# Altium schematic sheet Radio.SchDoc: CATS Telemetry
size A4; Author: Luca Jost; Revision: 1.0; SheetNumber: 5; SheetTotal: 7; Subtitle: Radio
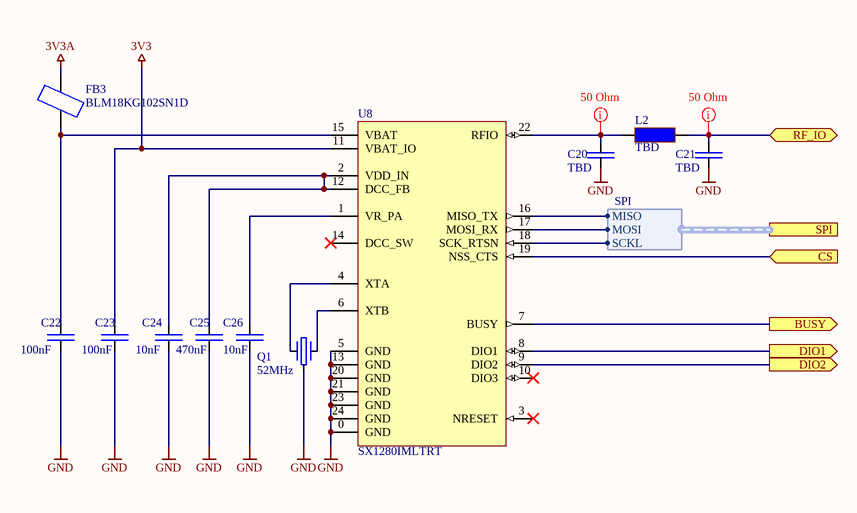
[diagram p0: Radio.SchDoc]

## Parts
C20  TBD  [SMD Keramikkondensator 0402]
C21  TBD  [SMD Keramikkondensator 0402]
C22  100nF  [SMD Keramikkondensator 0603]
C23  100nF  [SMD Keramikkondensator 0603]
C24  10nF  [SMD Keramikkondensator 0603]
C25  470nF  [SMD Keramikkondensator 0603]
C26  10nF  [SMD Keramikkondensator 0603]
FB3  BLM18KG102SN1D  [SMD Ferrite Bead 0603]
L2  TBD  [SMD Ferrite Bead 0402]
Q1  52MHz  [SMD Crystal 3.2X2.5X0.8]
U8  SX1280IMLTRT  [SMD IC QFN-24]

## Ports
BUSY (out), CS (in), DIO1 (out), DIO2 (out), RF_IO (bidir), SPI (harness SPI)

## Harnesses
SPI: SCKL, MOSI, MISO

## Nets
3V3: C23.2 U8.11(VBAT_IO)
3V3A: FB3.2
GND: C20.1 C21.1 C22.1 C23.1 C24.1 C25.1 C26.1 Q1.3 U8.0(GND) U8.5(GND) U8.13(GND) U8.20(GND) U8.21(GND) U8.23(GND) U8.24(GND)
BUSY: U8.7(BUSY) ; port BUSY
CS: U8.19(NSS_CTS) ; port CS
DIO1: U8.8(DIO1) ; port DIO1
DIO2: U8.9(DIO2) ; port DIO2
RF_IO: C21.2 L2.2 ; port RF_IO
NetC20_2: C20.2 L2.1 U8.22(RFIO)
NetC22_2: C22.2 FB3.1 U8.15(VBAT)
NetC24_2: C24.2 C25.2 U8.2(VDD_IN) U8.12(DCC_FB)
NetC26_2: C26.2 U8.1(VR_PA)
NetQ1_1: Q1.1 U8.4(XTA)
NetQ1_2: Q1.2 U8.6(XTB)
NetU8_16: U8.16(MISO_TX) ; port SPI.MISO
NetU8_17: U8.17(MOSI_RX) ; port SPI.MOSI
NetU8_18: U8.18(SCK_RTSN) ; port SPI.SCKL

Not connected (* = marked no-connect by the designer): U8 3(NRESET)* 10(DIO3)* 14(DCC_SW)*

## Layout directives
rule Impedance Constraint [Min = 50.00    Max = 50.00    ]; net class RF-Line 50: NetC20_2, RF_IO

## Notes on the sheet
- Title
- Author:
- Subtitle
- Date:
- Rev:
- CATS
- Sheet
- of
- File:

## Library data of the parts
C20 C21 = E6 - 10pF: SMD Ceramic Capacitor E6; Unit Price: 0.01; Number: -; Supplier: -
C22 C23 = E6 - 100nF: SMD Ceramic Capacitor E6; Unit Price: 0.01; Number: -; Supplier: -
C24 C26 = E6 - 10nF: SMD Ceramic Capacitor E6; Unit Price: 0.01; Number: -; Supplier: -
C25 = E6 - 470nF: SMD Ceramic Capacitor E6; Unit Price: 0.01; Number: -; Supplier: -
FB3 = BLM18KG102SN1D: 1 kOhms @ 100MHz 1 Power Line Ferrite Bead 0603 (1608 Metric) 1A 200mOhm; ComponentLink1Description: Datasheet; ComponentLink1URL: https://www.murata.com/en-us/products/productdata/8796738650142/ENFA0003.pdf; Digikey: 490-17349-1-ND
L2 = Inductor Pi-Matching: Pi-Matchng Inductor
Q1 = Crystal 52MHz - FL520WFMT1: 52MHz ±7ppm Crystal 12pF 30 Ohms 4-SMD, No Lead; ComponentLink1Description: Datasheet; ComponentLink1URL: https://www.diodes.com/assets/Datasheets/FL.pdf
U8 = SX1280IMLTRT: Long Range, Low Power, 2.4 GHz / Transceiver with Ranging Capability; ComponentLink1Description: Datasheet; ComponentLink1URL: https://media.digikey.com/pdf/Data%20Sheets/Semtech%20PDFs/SX1280-81_Rev3.2_Mar2020.pdf; Digikey: SX1280IMLTRTCT-ND